# EAGLE design teensy_audio_conn_sm_print (EAGLE 7.5.0)
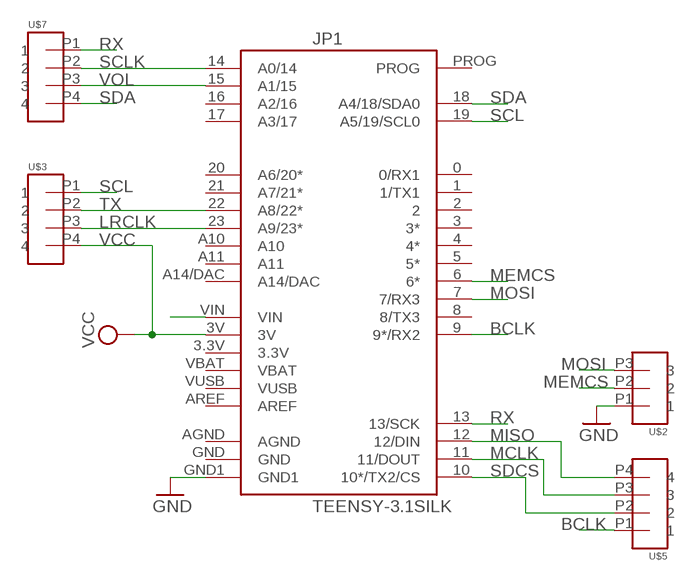
[diagram p0: schematic, sheet 1]

## Parts
JP1  TEENSY-3.1SILK  [TEENSY-3.1]
U$2  PTSM0,3-HH-2,5-SMD-R44  [M03_SMD_RIGHT]
U$3  PTSM0,4-HH-2,5-SMD-R44  [M04_SMD_RIGHT]
U$5  PTSM0,4-HH-2,5-SMD-R44  [M04_SMD_RIGHT]
U$7  PTSM0,4-HH-2,5-SMD-R44  [M04_SMD_RIGHT]

## Nets
BCLK: JP1.9(9*/RX2) U$5.P1
GND: JP1.GND1 U$2.P1
LRCLK: JP1.23(A9/23*) U$3.P3
MCLK: JP1.11(11/DOUT) U$5.P3
MEMCS: JP1.6(6*) U$2.P2
MISO: JP1.12(12/DIN) U$5.P4
MOSI: JP1.7(7/RX3) U$2.P3
RX: JP1.13(13/SCK) U$7.P1
SCL: JP1.19(A5/19/SCL0) U$3.P1
SCLK: JP1.14(A0/14) U$7.P2
SDA: JP1.18(A4/18/SDA0) U$7.P4
SDCS: JP1.10(10*/TX2/CS) U$5.P2
TX: JP1.22(A8/22*) U$3.P2
VCC: JP1.3V U$3.P4
VIN: JP1.VIN
VOL: JP1.15(A1/15) U$7.P3
Unconnected: JP1.0(0/RX1) JP1.1(1/TX1) JP1.2 JP1.3(3*) JP1.3.3V JP1.4(4*) JP1.5(5*) JP1.8(8/TX3) JP1.16(A2/16) JP1.17(A3/17) JP1.20(A6/20*) JP1.21(A7/21*) JP1.A10 JP1.A11 JP1.A14/DAC JP1.AGND JP1.AREF JP1.GND JP1.PROG JP1.VBAT JP1.VUSB

## Library data of the parts
JP1 = SparkFun-Boards:TEENSY-3.1; SF_ID: DEV-12646
U$2 = PTSM_Connector:PTSM0,3-HH-2,5-SMD-R44
U$3 U$5 U$7 = PTSM_Connector:PTSM0,4-HH-2,5-SMD-R44

## Board
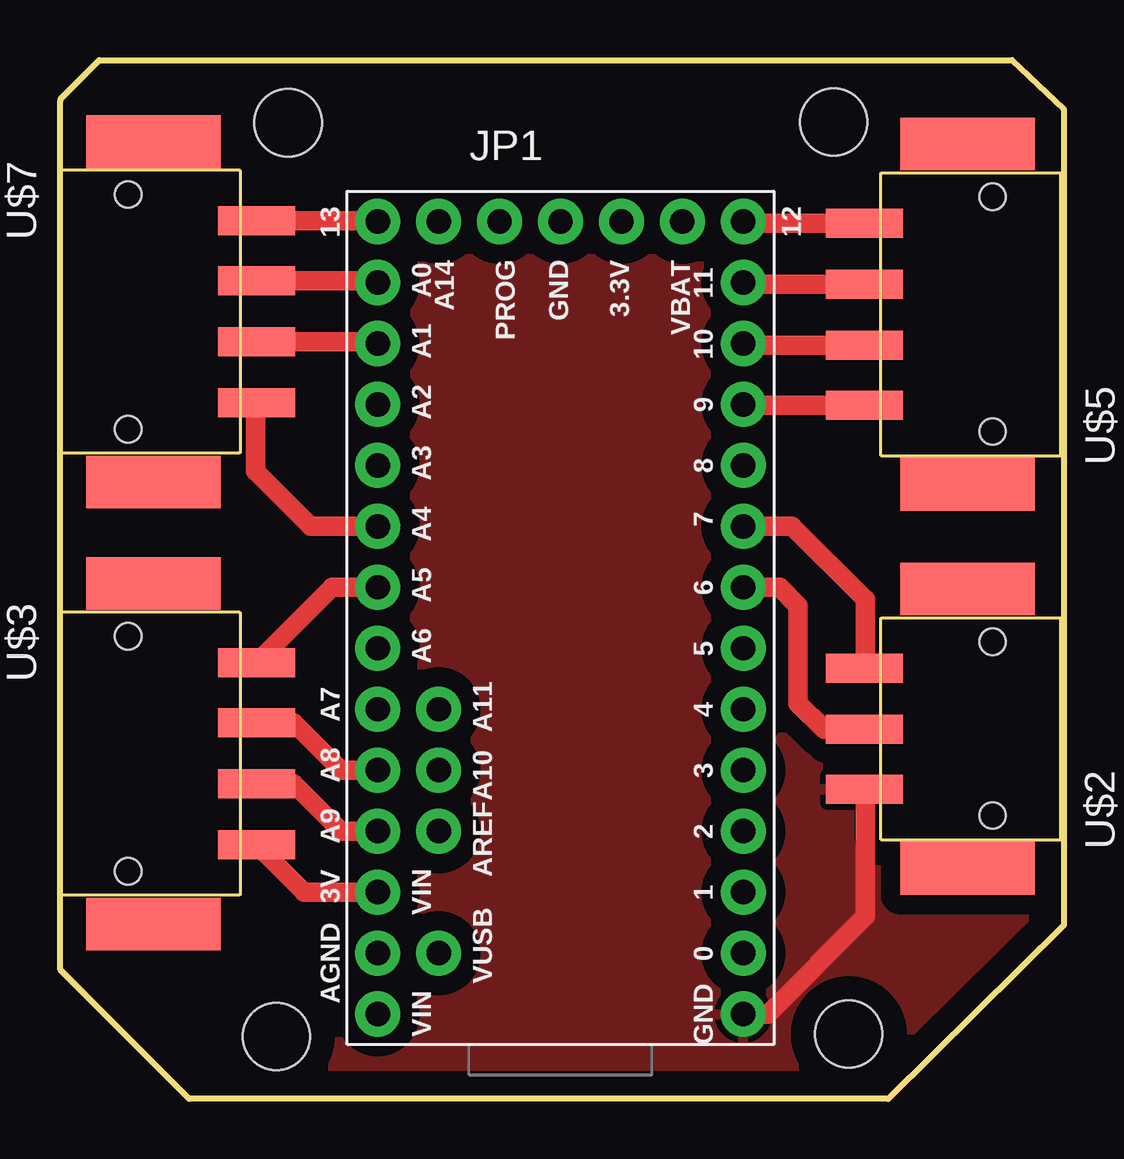
[diagram p1: board, top side]
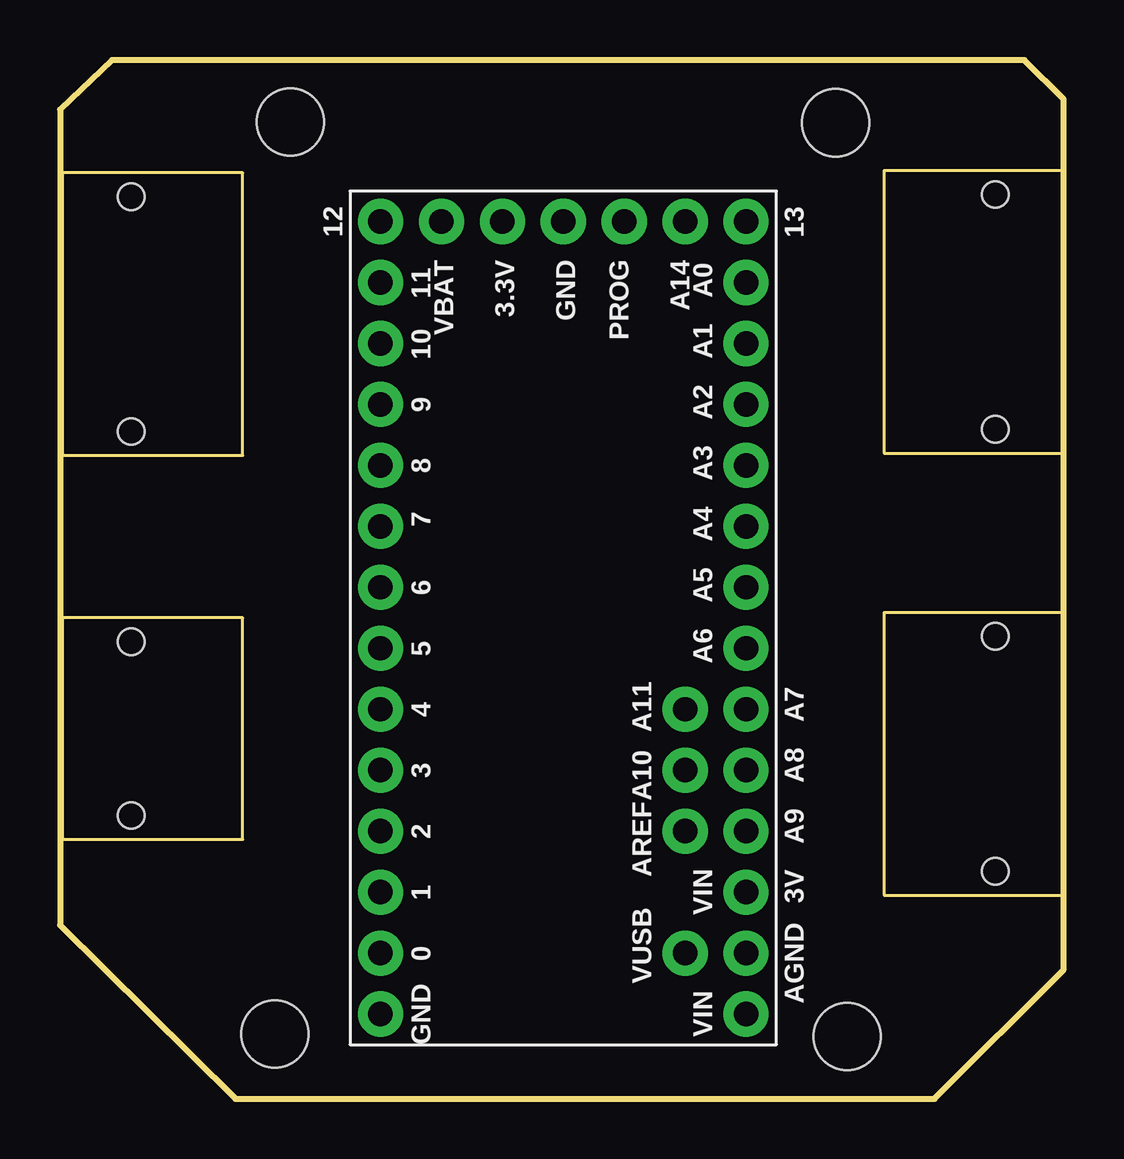
[diagram p2: board, bottom side, seen from below]

Size 41.84 x 43.28 mm. Coordinates in mm from the lower left corner, seen from the top.
Outline: 0.01,41.58 0.01,5.38 5.39,0 34.53,0 41.84,7.24 41.84,41.22 39.68,43.28 1.64,43.28 0.01,41.66
Copper layers (1*16): Top 0.035mm / dielectric 1.5mm / Bottom 0.035mm
Design rules "default": minimum track width 10mil, minimum drill 24mil, track to track 8mil, track to pad 8mil, pad to pad 8mil, via to via 8mil, smd to smd 8mil, copper to edge 40mil, drill to drill 8mil, minimum pad ring 10mil, minimum via ring 8mil, stop-mask expansion 4mil, vias tented up to drill 0mil, thermal gap 10mil
Holes 2.8 mm at 9.51,40.67 32.24,40.69 32.88,2.69 9.03,2.59

### Footprints (pad centres in the part's own frame; a part is rotated, then mirrored left to right if it is on the bottom)
TEENSY-3.1 = drill 1.016 pad 1.88: 0 16.51,3.81; 1 16.51,6.35; 2 16.51,8.89; 3 16.51,11.43; 3.3V 11.43,34.29; 3V 1.27,6.35; 4 16.51,13.97; 5 16.51,16.51; 6 16.51,19.05; 7 16.51,21.59; 8 16.51,24.13; 9 16.51,26.67; 10 16.51,29.21; 11 16.51,31.75; 12 16.51,34.29; 13 1.27,34.29; 14 1.27,31.75; 15 1.27,29.21; 16 1.27,26.67; 17 1.27,24.13; 18 1.27,21.59; 19 1.27,19.05; 20 1.27,16.51; 21 1.27,13.97; 22 1.27,11.43; 23 1.27,8.89; A10 3.81,11.43; A11 3.81,13.97; A14/DAC 3.81,34.29; AGND 1.27,3.81; AREF 3.81,8.89; GND 8.89,34.29; GND1 16.51,1.27; PROG 6.35,34.29; VBAT 13.97,34.29; VIN 1.27,1.27; VUSB 3.81,3.81
M03_SMD_RIGHT = smd 2.2 x 5.6: B1 -5.87,1.07; B2 5.77,1.07 | smd 1.2 x 3.2: P1 -2.57,5.37; P2 -0.07,5.37; P3 2.47,5.37 | hole 1.1: -3.67,0.02; 3.57,0.02
M04_SMD_RIGHT = smd 2.2 x 5.6: B1 -7.14,1.07; B2 7.04,1.07 | smd 1.2 x 3.2: P1 -3.84,5.37; P2 -1.34,5.37; P3 1.2,5.37; P4 3.74,5.37 | hole 1.1: -4.94,0.02; 4.84,0.02

### Placement (x,y rotation side)
JP1  11.97,2.26 0 top
U$2  38.9,15.47 90 top
U$3  2.83,14.33 270 top
U$5  38.9,32.74 90 top
U$7  2.83,32.74 270 top

### Tracks (layer width: path | path; a pad name or v marks a point on that pad's centre or on a via)
BCLK
  Top 0.813: U$5.P1 28.51,28.9 JP1.9
GND
  Top 0.813: JP1.GND1 29.5,3.53 33.56,7.59 33.56,12.86 U$2.P1
  pour Top (isolate 0.813): -2.25,43.61 44.21,43.61 44.21,-0.79 -2.33,-0.79 -2.33,43.43
LRCLK
  Top 0.813: U$3.P3 9.75,13.13 11.72,11.15 JP1.23
MCLK
  Top 0.813: U$5.P3 28.55,33.94 JP1.11
MEMCS
  Top 0.813: JP1.6 30.01,21.31 30.77,20.55 30.77,16.48 31.86,15.4 U$2.P2
MISO
  Top 0.813: U$5.P4 28.55,36.48 JP1.12
MOSI
  Top 0.813: JP1.7 30.52,23.85 33.56,20.8 33.56,17.97 U$2.P3
RX
  Top 0.813: U$7.P1 13.21,36.58 JP1.13
SCL
  Top 0.813: U$3.P1 11.35,21.31 JP1.19
SCLK
  Top 0.813: U$7.P2 13.17,34.08 JP1.14
SDA
  Top 0.813: JP1.18 10.45,23.85 8.16,26.14 8.16,28.96 U$7.P4
SDCS
  Top 0.813: U$5.P2 28.55,31.4 JP1.10
TX
  Top 0.813: U$3.P2 9.75,15.67 11.72,13.69 JP1.22
VCC
  Top 0.813: U$3.P4 10.18,8.61 JP1.3V
VOL
  Top 0.813: U$7.P3 13.17,31.54 JP1.15